# EAGLE schematic resistor-voltage-divider (EAGLE 9.5.2)
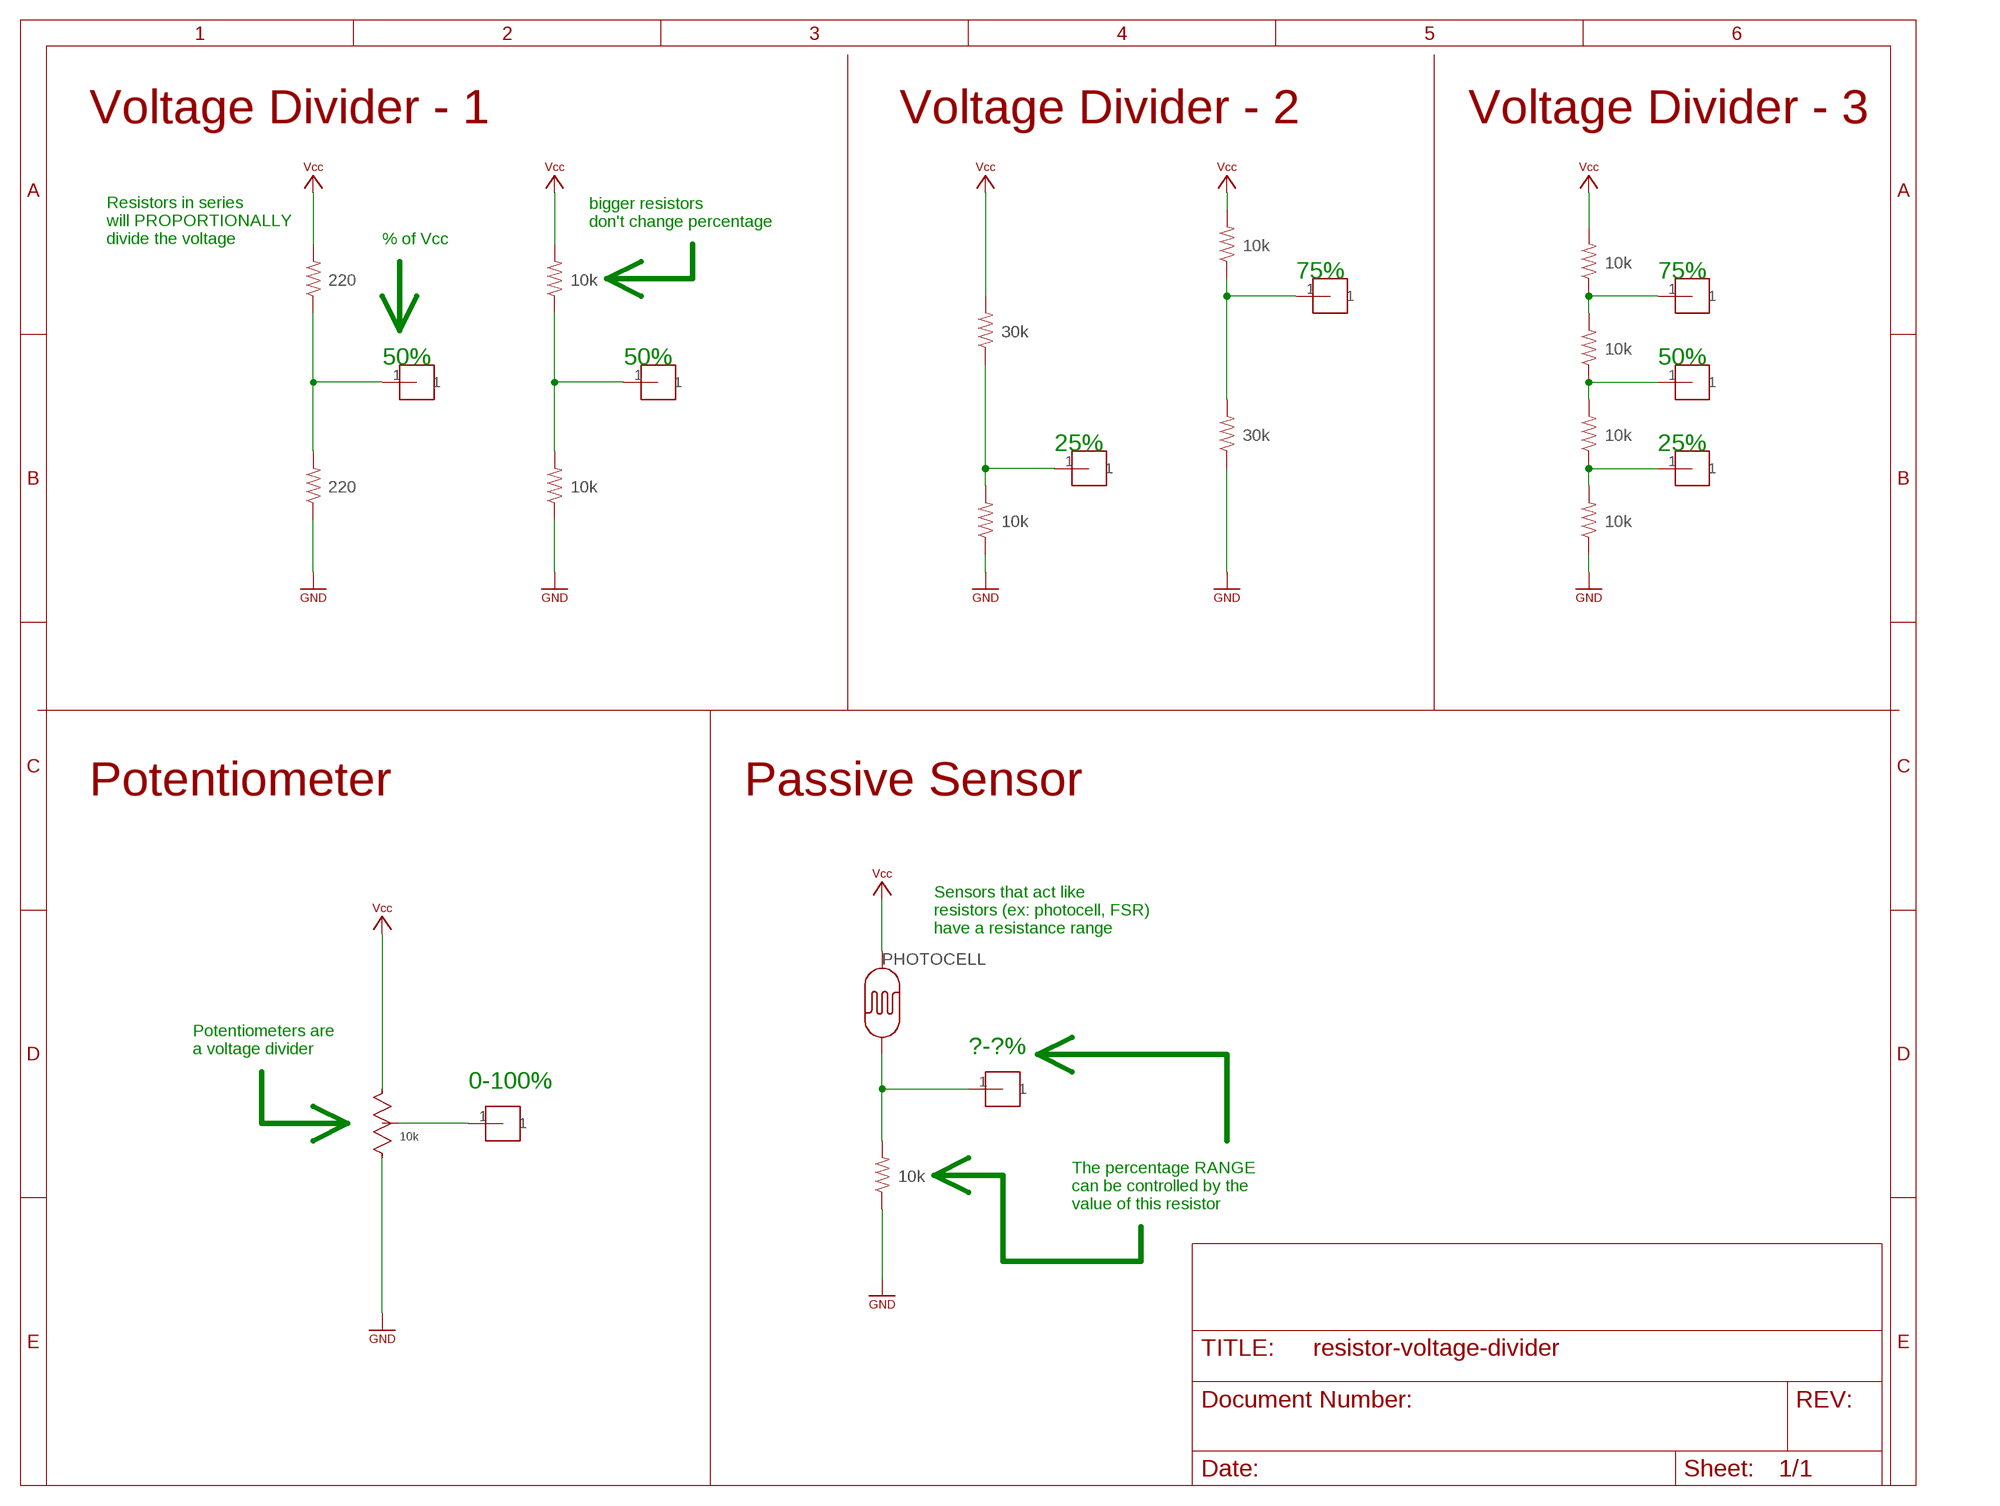
[diagram p0: schematic, sheet 1]

## Parts
PHOTOCELL  PHOTOCELLPTH  [PHOTOCELL]
R13  220  COMPONENT_RESISTOR-0805  [0805]
R15  220  COMPONENT_RESISTOR-0805  [0805]
R16  10k  COMPONENT_RESISTOR-0805  [0805]
R17  10k  COMPONENT_RESISTOR-0805  [0805]
R18  10k  COMPONENT_RESISTOR-0805  [0805]
R19  30k  COMPONENT_RESISTOR-0805  [0805]
R20  30k  COMPONENT_RESISTOR-0805  [0805]
R21  10k  COMPONENT_RESISTOR-0805  [0805]
R22  10k  COMPONENT_RESISTOR-0805  [0805]
R23  10k  COMPONENT_RESISTOR-0805  [0805]
R24  10k  COMPONENT_RESISTOR-0805  [0805]
R25  10k  COMPONENT_RESISTOR-0805  [0805]
R26  10k  COMPONENT_RESISTOR-0805  [0805]
U$1  HEADER-1-TESTPOINT  [TESTPOINT-1]
U$2  HEADER-1-TESTPOINT  [TESTPOINT-1]
U$3  HEADER-1-TESTPOINT  [TESTPOINT-1]
U$4  HEADER-1-TESTPOINT  [TESTPOINT-1]
U$5  HEADER-1-TESTPOINT  [TESTPOINT-1]
U$6  HEADER-1-TESTPOINT  [TESTPOINT-1]
U$7  HEADER-1-TESTPOINT  [TESTPOINT-1]
U$8  HEADER-1-TESTPOINT  [TESTPOINT-1]
U$9  HEADER-1-TESTPOINT  [TESTPOINT-1]
U$10  10k  COMPONENT_POTENTIOMETER  [TC33X-2-103E]

## Nets
GND: R13.1 R17.1 R18.1 R20.1 R25.1 R26.1 U$10.3(B) ; supply symbol labelled SYMBOL_GND
N$1: R13.2 R15.1 U$1.1
N$2: R16.1 R17.2 U$2.1
N$3: R18.2 R19.1 U$3.1
N$4: R20.2 R21.1 U$4.1
N$5: U$9.1 U$10.2(WIPER)
N$7: R22.1 R23.2 U$5.1
N$8: R24.1 R25.2 U$7.1
N$9: R23.1 R24.2 U$6.1
N$11: PHOTOCELL.1 R26.2 U$8.1
VCC: PHOTOCELL.2 R15.2 R16.2 R19.2 R21.2 R22.2 U$10.1(A) ; supply symbol labelled SYMBOL_VCC

## Notes on the sheet
- Voltage Divider - 1 | Voltage Divider - 2 | Voltage Divider - 3
- bigger resistors
  don't change percentage
- Resistors in series
  will PROPORTIONALLY
  divide the voltage
- % of Vcc
- 75% | 75%
- 50% | 50% | 50%
- 25% | 25%
- Potentiometer | Passive Sensor
- Sensors that act like
  resistors (ex: photocell, FSR)
  have a resistance range
- Potentiometers are
  a voltage divider
- ?-?%
- 0-100%
- The percentage RANGE
  can be controlled by the
  value of this resistor

## Library data of the parts
PHOTOCELL = SparkFun-Sensors:PHOTOCELL: Photocell (Photodetector, Photo Resistor, CdS) This is a very small light sensor. A photocell changes (also called a photodetector, photo resistor, CdS or photoconductive cell) resistance depending on the amount of light it is exposed to. These little sensors make great ambient light triggers (when light in the room turns on, do something). Datasheet <http://cdn.sparkfun.com/datasheets/Sensors/LightImaging/SEN-09088.pdf> SparkFun Products Mini Photocell <https://www.sparkfun.com/products/9088> (SEN-09088); PROD_ID: COMP-09129; SF_ID: SEN-09088
R13 R15-R26 = homemade-hardware:COMPONENT_RESISTOR
U$1-U$9 = homemade-hardware:HEADER-1: M20-8890845 <https://www.digikey.com/products/en?keywords=952-3236-ND>: Horizontal Male SMD Headers M20-7910842R <https://www.digikey.com/product-detail/en/harwin-inc/M20-7910842R/952-3200-6-ND/6559341>: Horizontal Female SMD Headers
U$10 = homemade-hardware:COMPONENT_POTENTIOMETER: TC33X-2-103E <https://www.digikey.com/product-detail/en/bourns-inc/TC33X-2-103E/TC33X-103EDKR-ND/1785031>: 10K Potentiometer - 0.1W; PN: TC33X-2-103E